# EAGLE design DS1339B_RTC_breakout (EAGLE 7.6.0)
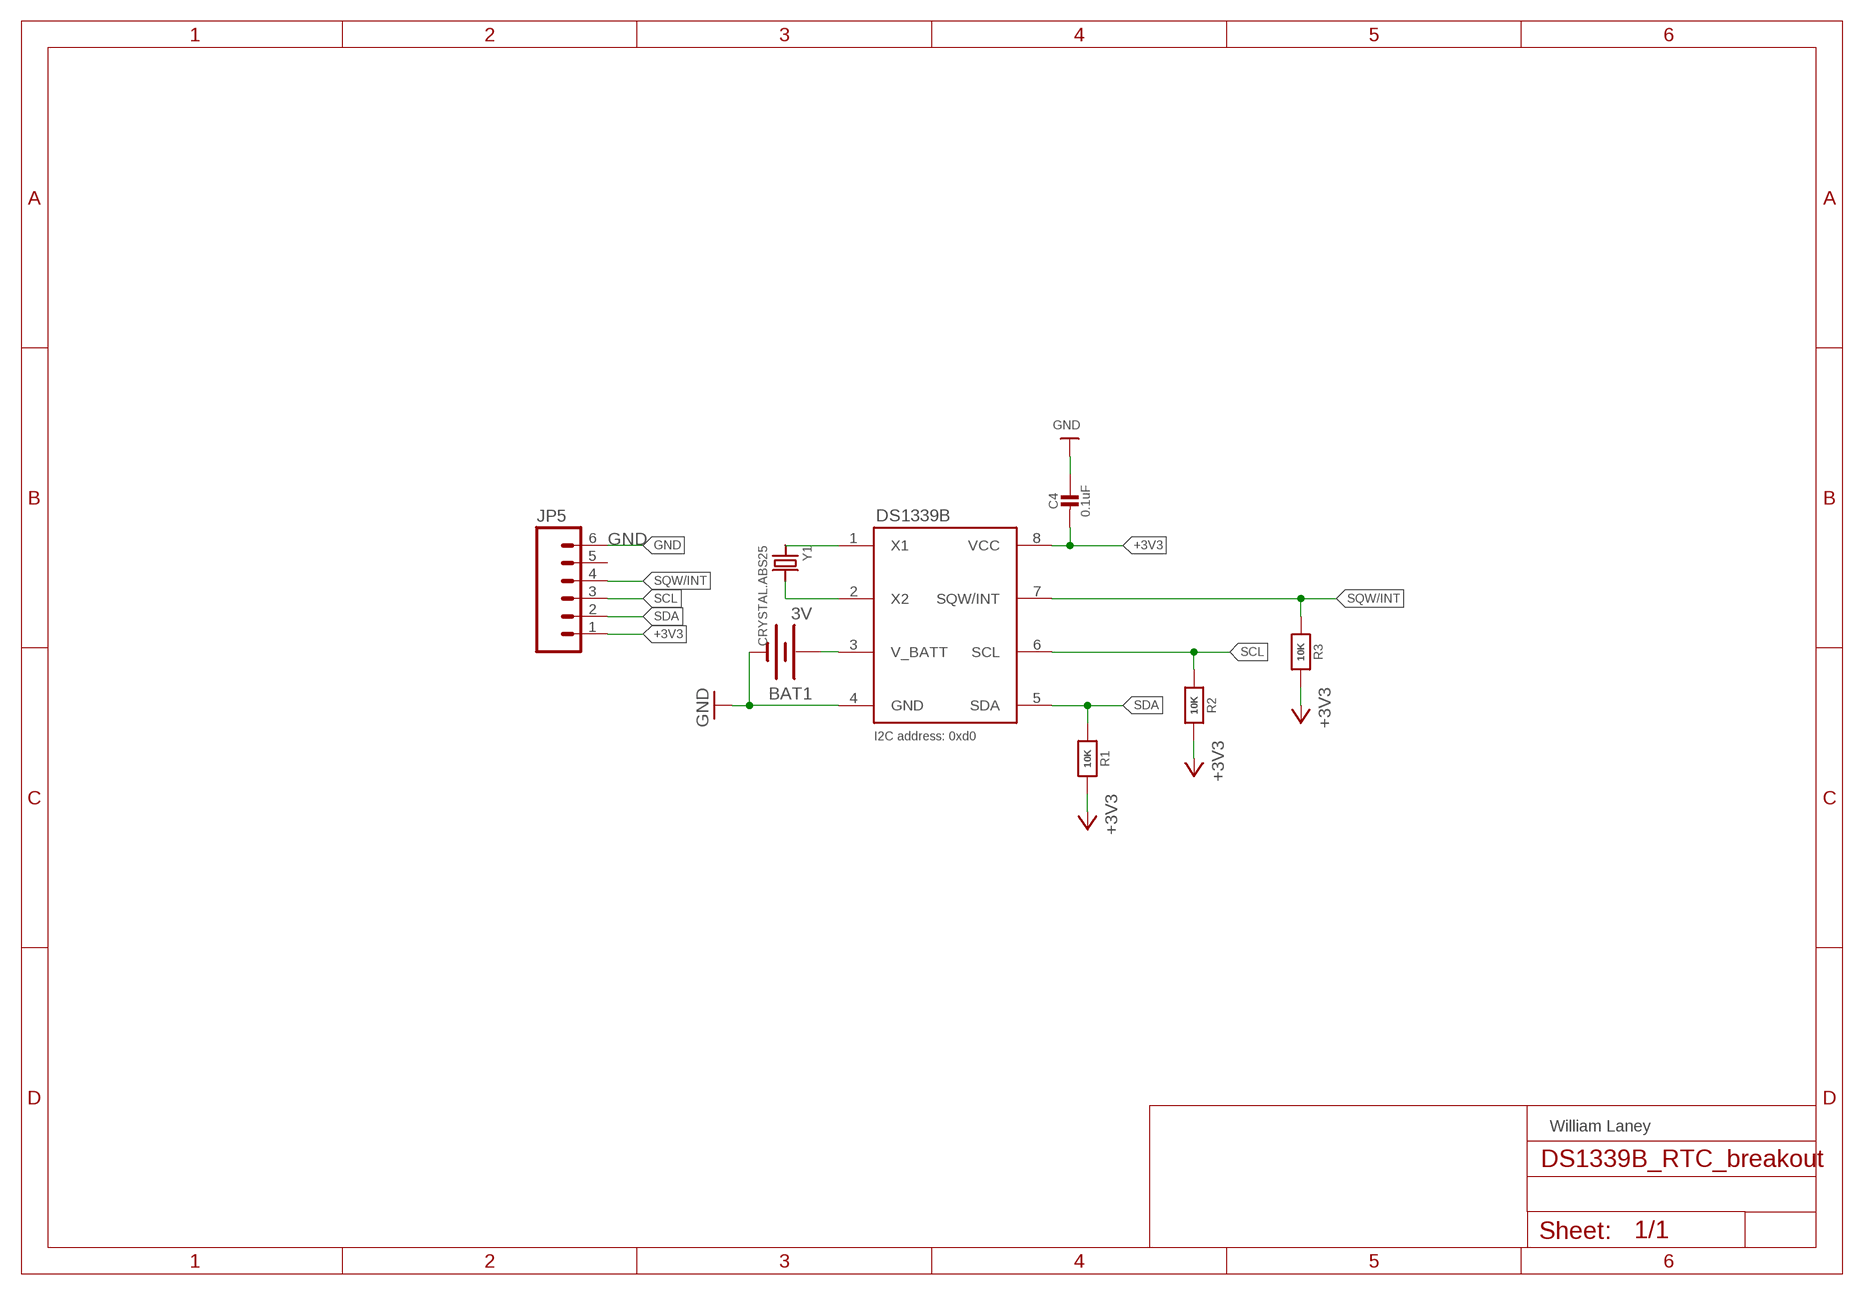
[diagram p0: schematic, sheet 1]

## Parts
BAT1  3V  BATTERY  [BATTCON_12MM_CURVED]
C4  0.1uF  CAP_CERAMIC0805-NOOUTLINE  [0805-NO]
JP5  M06SIP  [1X06]
R1  10K  RESISTOR0805_NOOUTLINE  [0805-NO]
R2  10K  RESISTOR0805_NOOUTLINE  [0805-NO]
R3  10K  RESISTOR0805_NOOUTLINE  [0805-NO]
U$1  DS1339BDS1339B  [8U-SOP]
Y1  CRYSTAL.ABS25  [ABS25]

## Nets
+3V3: C4.2 JP5.1 R1.2 R2.2 R3.2 U$1.8(VCC)
GND: BAT1.GND(-) C4.1 JP5.6 U$1.4(GND)
N$1: U$1.1(X1) Y1.1
N$2: U$1.2(X2) Y1.4
N$3: BAT1.PWR@1(+) U$1.3(V_BATT)
SCL: JP5.3 R2.1 U$1.6(SCL)
SDA: JP5.2 R1.1 U$1.5(SDA)
SQW/INT: JP5.4 R3.1 U$1.7(SQW/INT)
Unconnected: JP5.5

## Notes on the sheet
- I2C address: 0xd0
- William Laney

## Library data of the parts
BAT1 = SparkFun:BATTERY: Battery Holders Various common sizes : AA, AAA, 20mm coin cell and 12mm coin cell.
C4 = microbuilder:CAP_CERAMIC: Ceramic Capacitors For new designs, use the packages preceded by an '_' character since they are more reliable: The following footprints should be used on most boards: _0402 - Standard footprint for regular board layouts _0603 - Standard footprint for regular board layouts _0805 - Standard footprint for regular board layouts _1206 - Standard footprint for regular board layouts For extremely tight-pitch boards where space is at a premium, the following 'micro-pitch' footprints can be used (smaller pads, no silkscreen outline, etc.): _0402MP - Micro-pitch footprint for very dense/compact boards _0603MP - Micro-pitch footprint for very dense/compact boards _0805MP - Micro-pitch footprint for very dense/compact boards _1206MP - Micro-pitch footprint for very dense/compact boards
JP5 = SparkFun:M06: Header 6 Standard 6-pin 0.1" header. Use with straight break away headers (SKU : PRT-00116), right angle break away headers (PRT-00553), swiss pins (PRT-00743), machine pins (PRT-00117), and female headers (PRT-00115). Molex polarized connector foot print use with SKU : PRT-08094 with associated crimp pins and housings. NOTES ON THE VARIANTS LOCK and LOCK_LONGPADS... This footprint was designed to help hold the alignment of a through-hole component (i.e. 6-pin header) while soldering it into place. You may notice that each hole has been shifted either up or down by 0.005 of an inch from it's more standard position (which is a perfectly straight line). This slight alteration caused the pins (the squares in the middle) to touch the edges of the holes. Because they are alternating, it causes a "brace" to hold the component in place. 0.005 has proven to be the perfect amount of "off-center" position when using our standard breakaway headers. Although looks a little odd when you look at the bare footprint, once you have a header in there, the alteration is very hard to notice. Also, if you push a header all the way into place, it is covered up entirely on the bottom side. This idea of altering the position of holes to aid alignment will be further integrated into the Sparkfun Library for other footprints. It can help hold any component with 3 or more connection pins.
R1-R3 = microbuilder:RESISTOR: Resistors For new designs, use the packages preceded by an '_' character since they are more reliable: The following footprints should be used on most boards: _0402 - Standard footprint for regular board layouts _0603 - Standard footprint for regular board layouts _0805 - Standard footprint for regular board layouts _1206 - Standard footprint for regular board layouts For extremely tight-pitch boards where space is at a premium, the following 'micro-pitch' footprints can be used (smaller pads, no silkscreen outline, etc.): _0402MP - Micro-pitch footprint for very dense/compact boards _0603MP - Micro-pitch footprint for very dense/compact boards _0805MP - Micro-pitch footprint for very dense/compact boards _1206MP - Micro-pitch footprint for very dense/compact boards
U$1 = sharkdunio:DS1339B: DS1339B RTC
Y1 = abracon:CRYSTAL

## Board
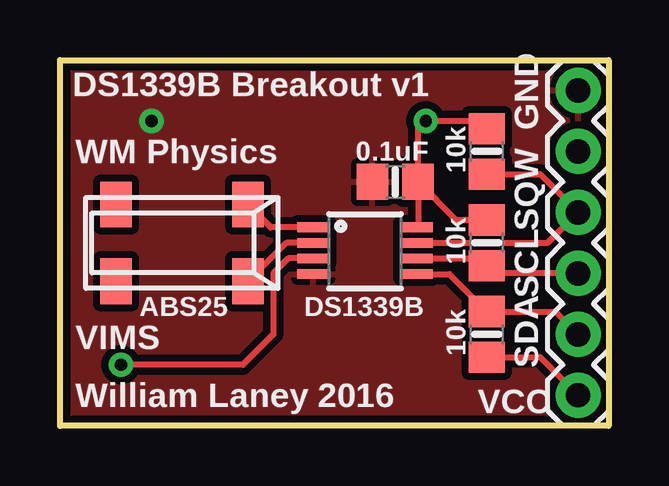
[diagram p1: board, top side]
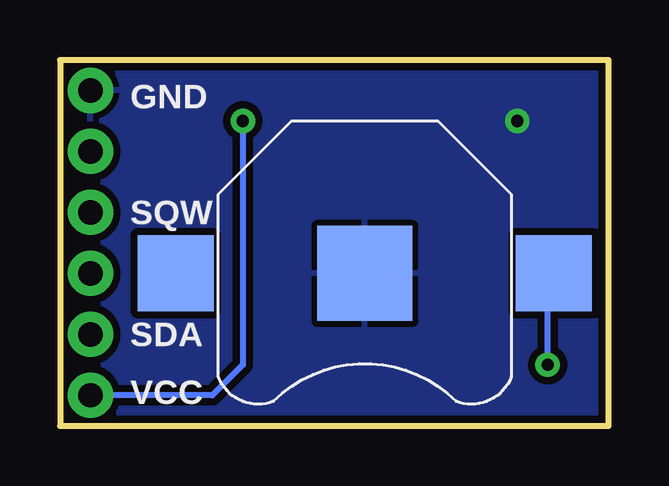
[diagram p2: board, bottom side, seen from below]

Size 22.86 x 15.24 mm. Coordinates in mm from the lower left corner, seen from the top.
Outline: 0,0 0,15.24 22.86,15.24 22.86,0 0,0
Copper layers (1*16): Top 0.035mm / dielectric 1.5mm / Bottom 0.035mm
Design rules "SparkFun": minimum track width 8mil, minimum drill 20mil, track to track 8mil, track to pad 8mil, pad to pad 8mil, via to via 8mil, smd to smd 8mil, copper to edge 8mil, drill to drill 8mil, minimum pad ring 12mil, minimum via ring 10mil, stop-mask expansion 4mil, vias tented up to drill 20mil, thermal gap 10mil

### Footprints (pad centres in the part's own frame; a part is rotated, then mirrored left to right if it is on the bottom)
BATTCON_12MM_CURVED = smd 3.962 x 3.962: GND 0,0 | smd 3.175 x 3.175: PWR@1 -7.874,0; PWR@2 7.874,0
0805-NO = smd 1.3 x 1.5: 1 -0.95,0; 2 0.95,0
1X06 = drill 1.016 pad 1.88: 1 0,0; 2 2.54,0; 3 5.08,0; 4 7.62,0; 5 10.16,0; 6 12.7,0
8U-SOP = smd 1.35 x 0.4: 1 -2.15,0.65; 2 -2.15,0; 3 -2.15,-0.65; 4 -2.15,-1.3; 5 2.15,-1.3; 6 2.15,-0.65; 7 2.15,0; 8 2.15,0.65
ABS25 = smd 1.3 x 1.9: 1 -2.75,-1.6; 2 2.75,-1.6; 3 2.75,1.6; 4 -2.75,1.6

### Placement (x,y rotation side)
BAT1  10.16,6.35 180 bottom
C4  13.97,10.16 0 top
JP5  21.59,1.27 90 top
R1  17.78,3.81 270 top
R2  17.78,7.62 90 top
R3  17.78,11.43 90 top
U$1  12.7,7.62 0 top
Y1  5.08,7.62 180 top

### Tracks (layer width: path | path; a pad name or v marks a point on that pad's centre or on a via)
+3V3  (via drill 0.51)
  Top 0.254: C4.2 14.92,8.34 U$1.8 | R2.2 16.51,8.57 C4.2 | R3.2 17.46,12.7 v15.24,12.7 14.92,12.38 C4.2 | R1.2 20,2.86 JP5.1
  Bottom 0.254: v15.24,12.7 15.24,2.54 16.51,1.27 JP5.1
GND  (via drill 0.51)
  other vias: 3.81,12.7
  pour Bottom (isolate 0.305): 0,15.24 22.86,15.24 22.86,0 0,0
  pour Top (isolate 0.305): 0,15.24 22.86,15.24 22.86,0 0,0
N$1
  Top 0.254: U$1.1 8.78,8.27 Y1.1
N$2
  Top 0.254: U$1.2 9.43,7.62 Y1.4
N$3  (via drill 0.51)
  Top 0.254: 10.78,6.97 U$1.3 9.51,6.97 8.89,6.35 8.89,3.81 7.62,2.54 v2.54,2.54
  Bottom 0.254: v2.54,2.54 2.54,7.37 BAT1.PWR@1
SCL
  Top 0.254: U$1.6 17.48,6.97 R2.1 18.1,6.35 JP5.3
SDA
  Top 0.254: U$1.5 16.22,6.32 R1.1 20.64,4.76 JP5.2
SQW/INT
  Top 0.254: U$1.7 20.32,7.62 JP5.4 20,10.48 R3.1

### Text on the board
tPlace: DS1339B Breakout v1 | GND | WM Physics | 0.1uF | 10k | SQW | 10k | ABS25 | DS1339B | SCL | VIMS | 10k | SDA | William Laney 2016 | VCC
bPlace: GND | SQW | SDA | VCC